# Altium project EL507-LAB002.PrjPcb
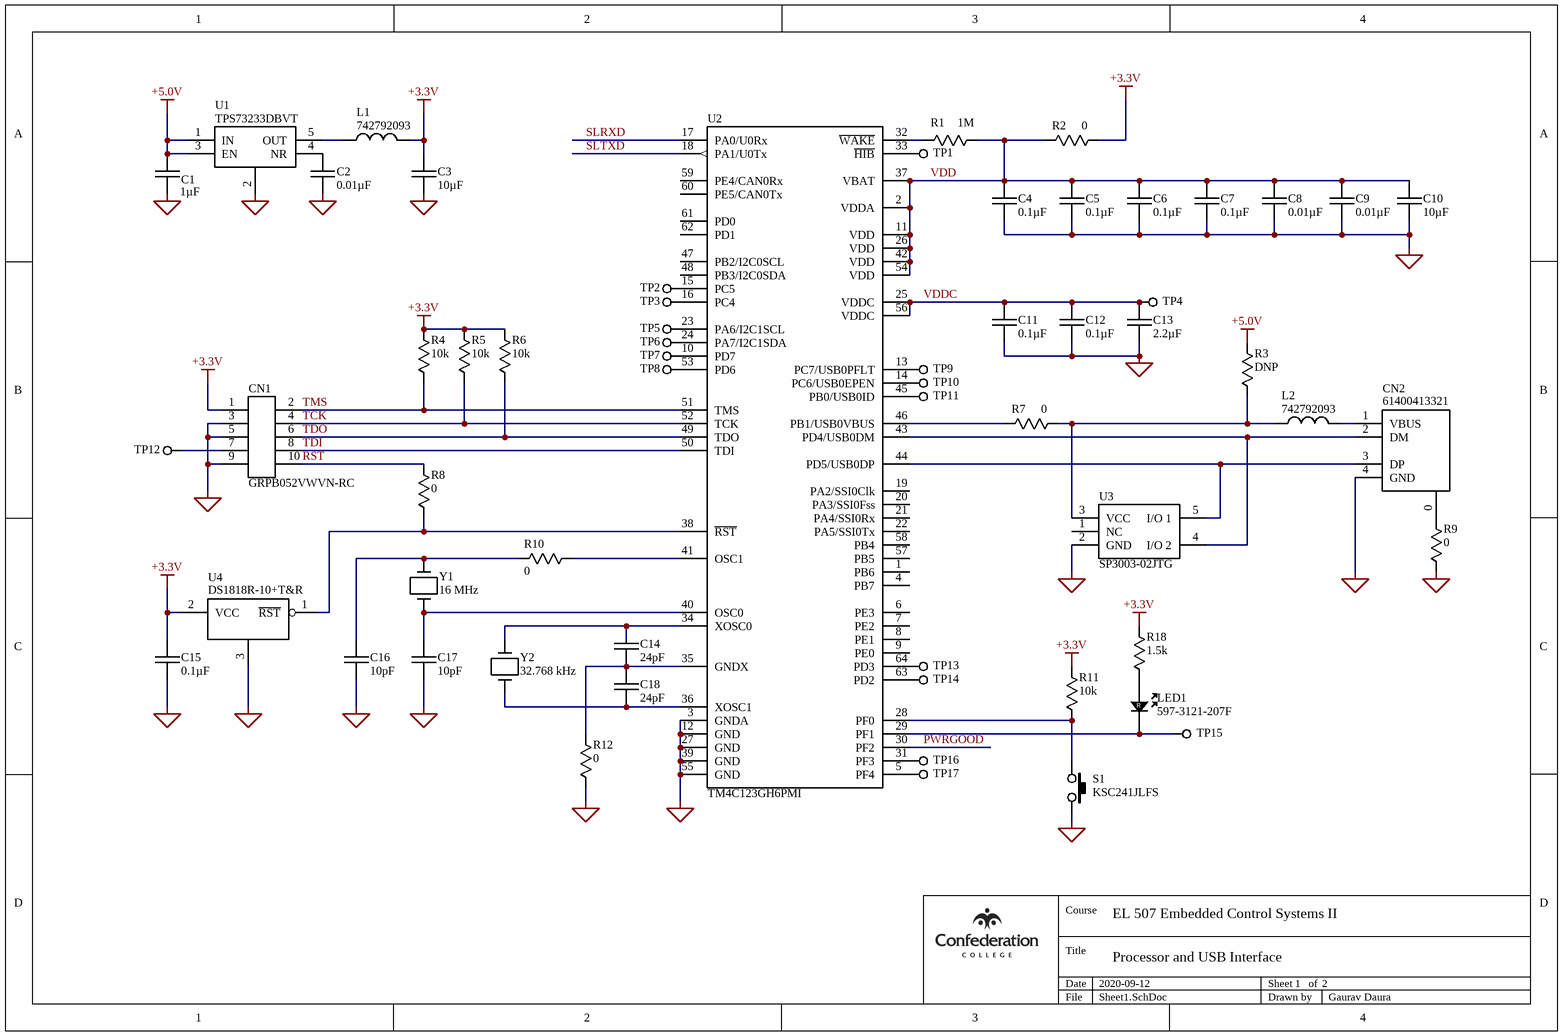
[diagram p0: Sheet1.SchDoc]
2 sheets, 93 parts. Net scope: global (net labels, ports and power ports of the same name join across sheets).
Board file: PCB001.PcbDoc
Sheets:
  Sheet1.SchDoc
  Sheet2.SchDoc

## Sheet Sheet1.SchDoc: Processor and USB Interface
size A4; Date: 2020-09-12; DrawnBy: Gaurav Daura; SheetNumber: 1; SheetTotal: 2

### Parts
C1  1µF  [CAPC2012X135N]
C2  0.01µF  [CAPC2012X78N]
C3  10µF  [CAPC3225X250N]
C4  0.1µF  [CAPC2012X125N]
C5  0.1µF  [CAPC2012X125N]
C6  0.1µF  [CAPC2012X125N]
C7  0.1µF  [CAPC2012X125N]
C8  0.01µF  [CAPC2012X78N]
C9  0.01µF  [CAPC2012X78N]
C10  10µF  [CAPC3225X250N]
C11  0.1µF  [CAPC2012X125N]
C12  0.1µF  [CAPC2012X125N]
C13  2.2µF  [CAPC2012X145N]
C14  24pF  [CAPC2012X75N]
C15  0.1µF  [CAPC2012X125N]
C16  10pF  [CAPC2012X94N]
C17  10pF  [CAPC2012X94N]
C18  24pF  [CAPC2012X75N]
CN1  GRPB052VWVN-RC  [SULLINS_GRPB052VWVN-RC]
CN2  61400413321  [WURTH_61400413321]
L1  742792093  [INDC2012X90N]
L2  742792093  [INDC2012X90N]
LED1  597-3121-207F  [DIALIGHT_597-3121-207F]
R1  1M  [RESC2012X60N]
R2  0  [RESC3216X60N]
R3  DNP  [RESC2012X60N]  (no BOM)
R4  10k  [RESC2012X60N]
R5  10k  [RESC2012X60N]
R6  10k  [RESC2012X60N]
R7  0  [RESC3216X60N]
R8  0  [RESC3216X60N]
R9  0  [RESC3216X60N]
R10  0  [RESC3216X60N]
R11  10k  [RESC2012X60N]
R12  0  [RESC3216X60N]
R18  1.5k  [RESC2012X60N]
S1  KSC241JLFS  [SW_KSC241JLFS]
TP1  TESTPOINT100  [TP100]  (value not drawn)  (no BOM)
TP2  TESTPOINT100  [TP100]  (value not drawn)  (no BOM)
TP3  TESTPOINT100  [TP100]  (value not drawn)  (no BOM)
TP4  TESTPOINT100  [TP100]  (value not drawn)  (no BOM)
TP5  TESTPOINT100  [TP100]  (value not drawn)  (no BOM)
TP6  TESTPOINT100  [TP100]  (value not drawn)  (no BOM)
TP7  TESTPOINT100  [TP100]  (value not drawn)  (no BOM)
TP8  TESTPOINT100  [TP100]  (value not drawn)  (no BOM)
TP9  TESTPOINT100  [TP100]  (value not drawn)  (no BOM)
TP10  TESTPOINT100  [TP100]  (value not drawn)  (no BOM)
TP11  TESTPOINT100  [TP100]  (value not drawn)  (no BOM)
TP12  TESTPOINT100  [TP100]  (value not drawn)  (no BOM)
TP13  TESTPOINT100  [TP100]  (value not drawn)  (no BOM)
TP14  TESTPOINT100  [TP100]  (value not drawn)  (no BOM)
TP15  TESTPOINT100  [TP100]  (value not drawn)  (no BOM)
TP16  TESTPOINT100  [TP100]  (value not drawn)  (no BOM)
TP17  TESTPOINT100  [TP100]  (value not drawn)  (no BOM)
U1  TPS73233DBVT  [SOT95P280X145-5N]
U2  TM4C123GH6PMI  [QFP50P1200X1200X140-64N]
U3  SP3003-02JTG  [SOT65P220X90-5N]
U4  DS1818R-10+T&R  [SOT95P235X100-3N]
Y1  16 MHz  [XTAL500X320X130]
Y2  32.768 kHz  [ABRACON_AB26TRB-32.768KHZ-T]

### Nets
+3.3V: C3.1 C15.1 CN1.1 L1.2 R2.2 R4.2 R5.2 R6.2 R11.2 R18.2 U4.2(VCC)
+5.0V: C1.1 R3.2 U1.1(IN) U1.3(EN)
GND: C1.2 C2.2 C3.2 C4.1 C5.1 C6.1 C7.1 C8.1 C9.1 C10.1 C11.1 C12.1 C13.2 C15.2 C16.2 C17.2 CN1.3 CN1.5 CN1.9 CN2.4(GND) R9.1 R12.1 S1.1 U1.2(GND) U2.3(GNDA) U2.12(GND) U2.27(GND) U2.39(GND) U2.55(GND) U3.2(GND) U4.3(GND)
PWRGOOD: U2.30(PF2)
RST: CN1.10 R8.2
SLRXD: U2.17(PA0/U0Rx)
SLTXD: U2.18(PA1/U0Tx)
TCK: CN1.4 R5.1 U2.52(TCK)
TDI: CN1.8 U2.50(TDI)
TDO: CN1.6 R6.1 U2.49(TDO)
TMS: CN1.2 R4.1 U2.51(TMS)
VDD: C4.2 C5.2 C6.2 C7.2 C8.2 C9.2 C10.2 R1.2 R2.1 U2.2(VDDA) U2.11(VDD) U2.26(VDD) U2.37(VBAT) U2.42(VDD) U2.54(VDD)
VDDC: C11.2 C12.2 C13.1 TP4.1 U2.25(VDDC) U2.56(VDDC)
NetC2_1: C2.1 U1.4(NR)
NetC14_1: C14.1 U2.34(XOSC0) Y2.2
NetC14_2: C14.2 C18.1 R12.2 U2.35(GNDX)
NetC16_1: C16.1 R10.1 Y1.2
NetC17_1: C17.1 U2.40(OSC0) Y1.1
NetC18_2: C18.2 U2.36(XOSC1) Y2.1
NetCN1_7: CN1.7 TP12.1
NetCN2_0: CN2.0 R9.2
NetCN2_1: CN2.1(VBUS) L2.2
NetCN2_2: CN2.2(DM) U2.43(PD4/USB0DM) U3.4(I/O_2)
NetCN2_3: CN2.3(DP) U2.44(PD5/USB0DP) U3.5(I/O_1)
NetL1_1: L1.1 U1.5(OUT)
NetL2_1: L2.1 R3.1 R7.2 U3.3(VCC)
NetLED1_1: LED1.1(K) TP15.1 U2.29(PF1)
NetLED1_2: LED1.2(A) R18.1
NetR1_1: R1.1 U2.32(~{WAKE})
NetR7_1: R7.1 U2.46(PB1/USB0VBUS)
NetR8_1: R8.1 U2.38(~{RST}) U4.1(~{RST})
NetR10_2: R10.2 U2.41(OSC1)
NetR11_1: R11.1 S1.2 U2.28(PF0)
NetTP1_1: TP1.1 U2.33(~{HIB})
NetTP2_1: TP2.1 U2.15(PC5)
NetTP3_1: TP3.1 U2.16(PC4)
NetTP5_1: TP5.1 U2.23(PA6/I2C1SCL)
NetTP6_1: TP6.1 U2.24(PA7/I2C1SDA)
NetTP7_1: TP7.1 U2.10(PD7)
NetTP8_1: TP8.1 U2.53(PD6)
NetTP9_1: TP9.1 U2.13(PC7/USB0PFLT)
NetTP10_1: TP10.1 U2.14(PC6/USB0EPEN)
NetTP11_1: TP11.1 U2.45(PB0/USB0ID)
NetTP13_1: TP13.1 U2.64(PD3)
NetTP14_1: TP14.1 U2.63(PD2)
NetTP16_1: TP16.1 U2.31(PF3)
NetTP17_1: TP17.1 U2.5(PF4)

Not connected (* = marked no-connect by the designer): U2 1(PB6) 4(PB7) 6(PE3) 7(PE2) 8(PE1) 9(PE0) 19(PA2/SSI0Clk) 20(PA3/SSI0Fss) 21(PA4/SSI0Rx) 22(PA5/SSI0Tx) 47(PB2/I2C0SCL) 48(PB3/I2C0SDA) 57(PB5) 58(PB4) 59(PE4/CAN0Rx) 60(PE5/CAN0Tx) 61(PD0) 62(PD1); U3 1(NC)

### Notes on the sheet
- Course
- EL 507 Embedded Control Systems II
- Title
- Date
- Sheet
- of
- File
- Drawn by
- (in symbol 597-3121-207F) R

### Library data of the parts
C1 = CL21B105KBFNNNE: 1µF/50V 10% X7R Multi-Layer Ceramic Capacitor; Manufacturer: Samsung Electro-Mechanics; CRN: 12041; PartNumber: CL21B105KBFNNNE
C2 C8 C9 = CL21B103KBANNNC: 0.01µF/50V 10% X7R Multi-Layer Ceramic Capacitor; Manufacturer: Samsung Electro-Mechanics; CRN: 12041; PartNumber: CL21B103KBANNNC
C3 C10 = UMK325C7106MM-T: 10µF/50V/20% Multilayer Ceramic Chip Capacitor; Manufacturer: Taiyo Yuden; CRN: 12041; PartNumber: UMK325C7106MM-T
C4-C7 C11 C12 C15 = GRM21BR71H104KA01L: 0.1µF/50V/±10% X7R Ceramic Chip Capacitor; Manufacturer: Murata Manufacturing Co., Ltd.; CRN: 12041; PartNumber: GRM21BR71H104KA01L
C13 = UMK212BB7225KG-T: 2.2µF/50V/10% Multilayer Ceramic Chip Capacitor; Manufacturer: Taiyo Yuden; CRN: 12041; PartNumber: UMK212BB7225KG-T
C14 C18 = CL21C240JBANNNC: 24pF/50V 5% C0G Multi-Layer Ceramic Capacitor; Manufacturer: Samsung Electro-Mechanics; CRN: 12041; PartNumber: CL21C240JBANNNC
C16 C17 = 08051A100KAT2A: 10pF 100V NP0 ±10% Ceramic Capacitor; Manufacturer: AVX Corporation; CRN: 12041; PartNumber: 08051A100KAT2A
CN1 = GRPB052VWVN-RC: .050"[1.27mm] Contact Centers, Male Header; Manufacturer: Sullins Connector Solutions, Inc.; CRN: 12041; PartNumber: GRPB052VWVN-RC
CN2 = 61400413321: Connector Receptacle USB Type B 4 Position Through Hole, Vertical; Manufacturer: Wurth Elektronik GmbH & Co. KG; CRN: 12041; PartNumber: 61400413321
L1 L2 = 742792093: Multilayer SMD Ferrite; Manufacturer: Wurth Elektronik GmbH & Co. KG; CRN: 12041; PartNumber: 742792093
LED1 = 597-3121-207F: Micro LED, 597 Series, Red, SMD LED; Manufacturer: Dialight Corporation; CRN: 12041; PartNumber: 597-3121-207F
R1 = ERJ-6ENF1004V: 1M, 1%, 0.125W Precision Thick Film Chip Resistor; Manufacturer: Panasonic Corporation of North America; CRN: 12041; PartNumber: ERJ-6ENF1004V; Value: 1M
R2 R7-R10 R12 = ERJ-8GEY0R00V: 0, 5%, 0.25W Thick Film Chip Resistor; Manufacturer: Panasonic Corporation of North America; CRN: 12041; PartNumber: ERJ-8GEY0R00V; Value: 0
R3 = DNP_RESC2012X60N: 2012 Chip Resistor; Manufacturer: Confederation College; CRN: 12041; PartNumber: -
R4-R6 R11 = ERJ-6ENF1002V: 10k, 1%, 0.125W Precision Thick Film Chip Resistor; Manufacturer: Panasonic Corporation of North America; CRN: 12041; PartNumber: ERJ-6ENF1002V; Value: 10k
R18 = ERJ-6ENF1501V: 1.5k, 1%, 0.125W Precision Thick Film Chip Resistor; Manufacturer: Panasonic Corporation of North America; CRN: 12041; PartNumber: ERJ-6ENF1501V; Value: 1.5k
S1 = KSC241JLFS: KSC Series Sealed Tact Switch for SMT; Manufacturer: C&K Components; CRN: 12041; PartNumber: KSC241JLFS
TP1-TP17 = TESTPOINT100: Test Point; Manufacturer: Confederation College; CRN: 12041; PartNumber: -
U1 = TPS73233DBVT: 250 mA, 3.3V Low Dropout Voltage Regulator; Manufacturer: Texas Instruments, Inc.; CRN: 12041; PartNumber: TPS73233DBVT
U2 = TM4C123GH6PMI: Tiva TM4C123GH6PM Microcontroller; Manufacturer: Texas Instruments, Inc.; CRN: 12041; PartNumber: TM4C123GH6PMI
U3 = SP3003-02JTG: TVS Diode Array - Low Capacitance ESD Protection; Manufacturer: Littelfuse, Inc.; CRN: 12041; PartNumber: SP3003-02JTG
U4 = DS1818R-10+T&R: 3.3 V EconoReset with Pushbutton; Manufacturer: Maxim Integrated; CRN: 12041; PartNumber: DS1818R-10+T&R
Y1 = ABM3-16.000MHZ-B2-T: 16 MHz Miniature Ceramic SMD Crystal; Manufacturer: Abracon Corporation; CRN: 12041; PartNumber: ABM3-16.000MHZ-B2-T
Y2 = AB26TRB-32.768KHZ-T: 32.768 kHz Radial Can Crystal; Manufacturer: Abracon Corporation; CRN: 12041; PartNumber: AB26TRB-32.768KHZ-T

## Sheet Sheet2.SchDoc: Power Supply and Serial Communications
size A4; Date: 2020-09-14; DrawnBy: Gaurav Daura; SheetNumber: 2; SheetTotal: 2
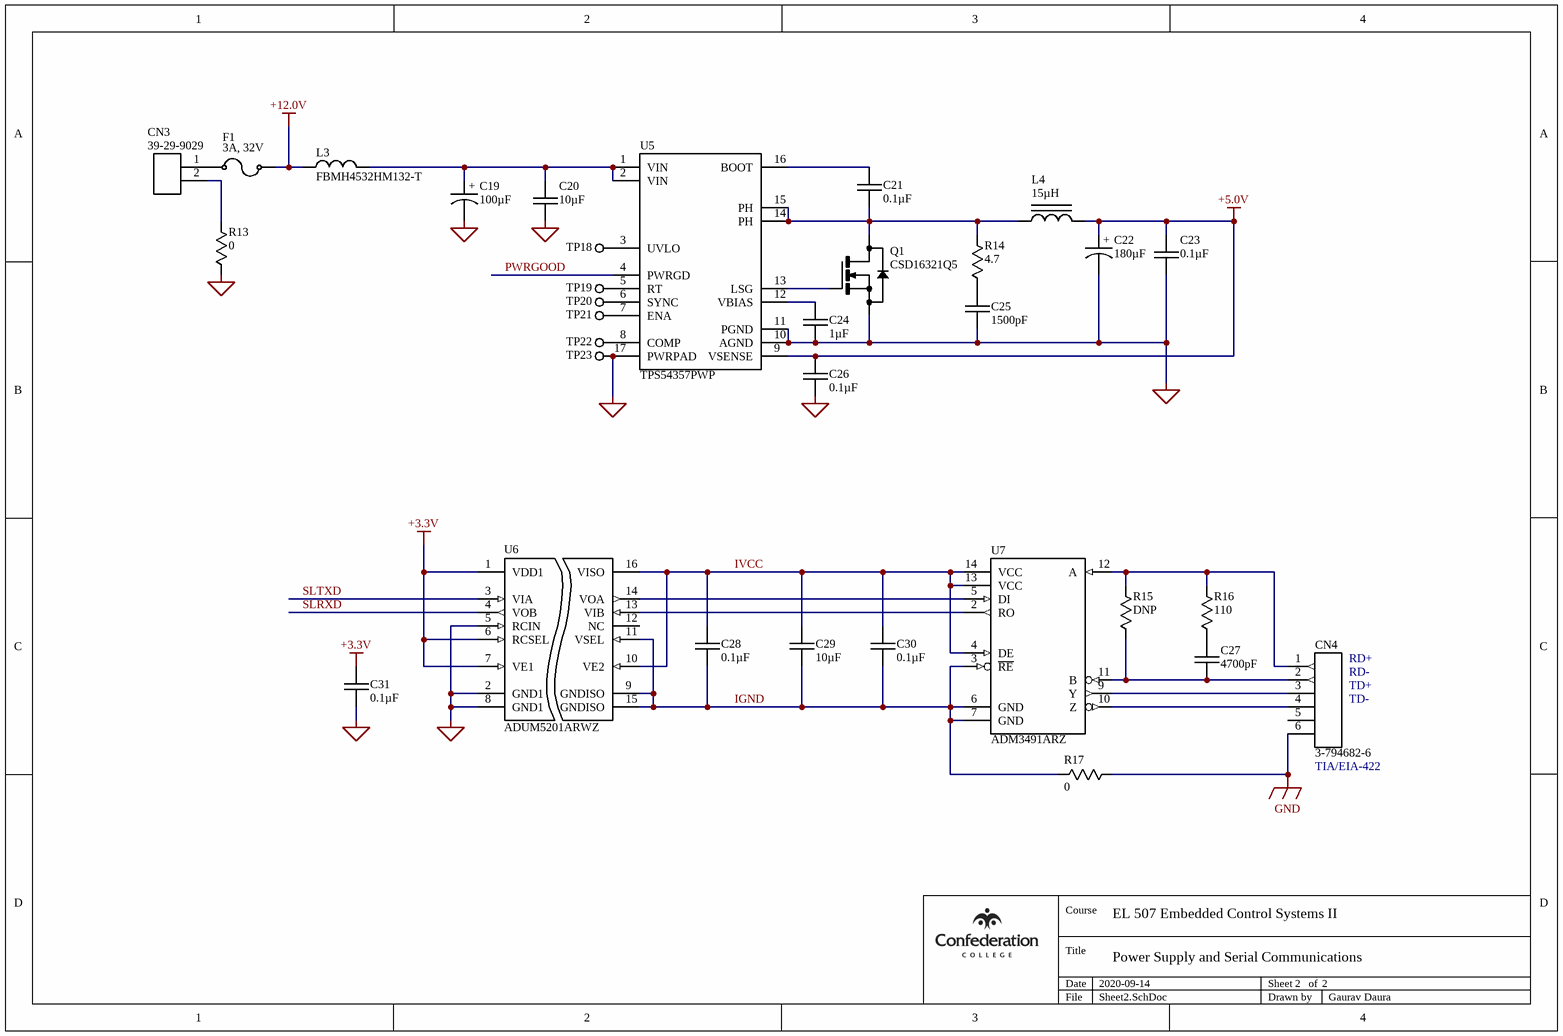
[diagram p1: Sheet2.SchDoc]

### Parts
C19  100µF  [CAPAE660X770N]
C20  10µF  [CAPC3225X250N]
C21  0.1µF  [CAPC2012X125N]
C22  180µF  [CAPMP7343X190N]
C23  0.1µF  [CAPC2012X125N]
C24  1µF  [CAPC2012X135N]
C25  1500pF  [CAPC2012X100N]
C26  0.1µF  [CAPC2012X125N]
C27  4700pF  [CAPC2012X78N]
C28  0.1µF  [CAPC2012X125N]
C29  10µF  [CAPC3225X250N]
C30  0.1µF  [CAPC2012X125N]
C31  0.1µF  [CAPC2012X125N]
CN3  39-29-9029  [MOLEX_39-29-9029]
CN4  3-794682-6  [TYCO_3-794682-6]
F1  3A, 32V  [FUSE_0468XXX.NR]
L3  FBMH4532HM132-T  [INDC4532X350N]
L4  15µH  [IND_SRU1038-150Y]
Q1  CSD16321Q5  [TI_CSD16321Q5]
R13  0  [RESC3216X60N]
R14  4.7  [RESC2012X60N]
R15  DNP  [RESC2012X60N]  (no BOM)
R16  110  [RESC2012X60N]
R17  0  [RESC3216X60N]
TP18  TESTPOINT100  [TP100]  (value not drawn)  (no BOM)
TP19  TESTPOINT100  [TP100]  (value not drawn)  (no BOM)
TP20  TESTPOINT100  [TP100]  (value not drawn)  (no BOM)
TP21  TESTPOINT100  [TP100]  (value not drawn)  (no BOM)
TP22  TESTPOINT100  [TP100]  (value not drawn)  (no BOM)
TP23  TESTPOINT100  [TP100]  (value not drawn)  (no BOM)
U5  TPS54357PWP  [SOP65P640X120-17AN]
U6  ADUM5201ARWZ  [SOIC127P1030X265-16N]
U7  ADM3491ARZ  [SOIC127P600X175-14N]

### Nets
+3.3V: C31.1 U6.1(VDD1) U6.6(RCSEL) U6.7(VE1)
+5.0V: C22.1 C23.1 C26.1 L4.2 U5.9(VSENSE)
+12.0V: F1.2 L3.1
GND: C19.2 C20.2 C22.2 C23.2 C24.2 C25.2 C26.2 C31.2 CN4.6 Q1.S R13.1 R17.2 TP23.1 U5.10(AGND) U5.11(PGND) U5.17(PWRPAD) U6.2(GND1) U6.5(RCIN) U6.8(GND1)
IGND: C28.2 C29.2 C30.2 R17.1 U6.9(GNDISO) U6.11(VSEL) U6.15(GNDISO) U7.3(~{RE}) U7.6(GND) U7.7(GND)
IVCC: C28.1 C29.1 C30.1 U6.10(VE2) U6.16(VISO) U7.4(DE) U7.13(VCC) U7.14(VCC)
PWRGOOD: U5.4(PWRGD)
SLRXD: U6.4(VOB)
SLTXD: U6.3(VIA)
NetC19_1: C19.1 C20.1 L3.2 U5.1(VIN) U5.2(VIN)
NetC21_1: C21.1 U5.16(BOOT)
NetC21_2: C21.2 L4.1 Q1.D R14.2 U5.14(PH) U5.15(PH)
NetC24_1: C24.1 U5.12(VBIAS)
NetC25_1: C25.1 R14.1
NetC27_1: C27.1 R16.1
NetC27_2: C27.2 CN4.2 R15.1 U7.11(B)
NetCN3_1: CN3.1 F1.1
NetCN3_2: CN3.2 R13.2
NetCN4_1: CN4.1 R15.2 R16.2 U7.12(A)
NetCN4_3: CN4.3 U7.9(Y)
NetCN4_4: CN4.4 U7.10(Z)
NetQ1_G: Q1.G U5.13(LSG)
NetTP18_1: TP18.1 U5.3(UVLO)
NetTP19_1: TP19.1 U5.5(RT)
NetTP20_1: TP20.1 U5.6(SYNC)
NetTP21_1: TP21.1 U5.7(ENA)
NetTP22_1: TP22.1 U5.8(COMP)
NetU6_13: U6.13(VIB) U7.2(RO)
NetU6_14: U6.14(VOA) U7.5(DI)

Not connected (* = marked no-connect by the designer): CN4 5; U6 12(NC)

### Notes on the sheet
- (near CN4) RD+
- (near CN4) RD-
- (near CN4) TD+
- (near CN4) TD-
- (near CN4) TIA/EIA-422
- Course
- EL 507 Embedded Control Systems II
- Title
- Date
- Sheet
- of
- File
- Drawn by
- (in symbol EEE-1EA101XP) +
- (in symbol EEF-SE0J181R) +

### Library data of the parts
C19 = EEE-1EA101XP: 100µF/25V/20% Aluminum Electrolytic Capacitor; Manufacturer: Panasonic Corporation of North America; CRN: 12041; PartNumber: EEE-1EA101XP
C20 C29 = UMK325C7106MM-T: as C3 on sheet Sheet1; PartNumber: UMK325C7106MM-T
C21 C23 C26 C28 C30 C31 = GRM21BR71H104KA01L: as C4 on sheet Sheet1; PartNumber: GRM21BR71H104KA01L
C22 = EEF-SE0J181R: 180µF/6.3V/20% Low ESR Polymer Aluminum Capacitor (SP-CAP); Manufacturer: Panasonic Corporation of North America; CRN: 12041; PartNumber: EEF-SE0J181R
C24 = CL21B105KBFNNNE: as C1 on sheet Sheet1; PartNumber: CL21B105KBFNNNE
C25 = GRM21AR72E152KW01D: 1500pF/250V/±10% X7R Ceramic Chip Capacitor; Manufacturer: Murata Manufacturing Co., Ltd.; CRN: 12041; PartNumber: GRM21AR72E152KW01D
C27 = C0805C472K5RACTU: 4700pF/50V/10% Ceramic Capacitor; Manufacturer: Kemet Electronics Corporation; CRN: 12041; PartNumber: C0805C472K5RACTU
CN3 = 39-29-9029: Mini-Fit Jr. Header, Dual Row, Vertical, with Snap-in Plastic Peg PCB Lock, 2 Circuits, PA Polyamide Nylon 6/6 94V-2, 0.76µm Gold (Au) Plating; Manufacturer: Molex Inc.; CRN: 12041; PartNumber: 39-29-9029
CN4 = 3-794682-6: 6 Circuit, Micro MATE-N-LOK 3 mm Vertical Connector; Manufacturer: Tyco Electronics Corporation; CRN: 12041; PartNumber: 3-794682-6
F1 = 0468003.NR: 1 A, 32 V, Slo-Blo, 468 Series Surface Mount Fuse; Manufacturer: Littelfuse, Inc.; CRN: 12041; PartNumber: 0468003.NR
L3 = FBMH4532HM132-T: Multilayer SMD Ferrite Bead, 3A, 1.3k @ 100 MHz; Manufacturer: Taiyo Yuden; CRN: 12041; PartNumber: FBMH4532HM132-T
L4 = SRU1038-150Y: 15µH Shielded SMD Power Inductor; Manufacturer: Bourns, Inc.; CRN: 12041; PartNumber: SRU1038-150Y
Q1 = CSD16321Q5: 25V, 31 A, N-Channel Power MOSFET; Manufacturer: Texas Instruments, Inc.; CRN: 12041; PartNumber: CSD16321Q5
R13 R17 = ERJ-8GEY0R00V: as R2 on sheet Sheet1; PartNumber: ERJ-8GEY0R00V; Value: 0
R14 = ERJ-6GEYJ4R7V: 4.7, ±5%, 0.125W Thick Film Chip Resistor; Manufacturer: Panasonic Corporation of North America; CRN: 12041; PartNumber: ERJ-6GEYJ4R7V; Value: 4.7
R15 = DNP_RESC2012X60N: as R3 on sheet Sheet1; PartNumber: -
R16 = ERJ-6ENF1100V: 110, 1%, 0.125W Precision Thick Film Chip Resistor; Manufacturer: Panasonic Corporation of North America; CRN: 12041; PartNumber: ERJ-6ENF1100V; Value: 110
TP18-TP23 = TESTPOINT100: as TP1 on sheet Sheet1; PartNumber: -
U5 = TPS54357PWP: 5V, 4.5V to 20V Input, 3A Output Synchronous PWM Switcher with Integrated FET (SWIFT); Manufacturer: Texas Instruments, Inc.; CRN: 12041; PartNumber: TPS54357PWP
U6 = ADUM5201ARWZ: 1Mbps Dual Channel Digital Isolator with isoPower Integrated DC-to-DC Converter, 2.5 kV; Manufacturer: Analog Devices, Inc.; CRN: 12041; PartNumber: ADUM5201ARWZ
U7 = ADM3491ARZ: 3.3 V, Full Duplex, 840 uA, 20 Mbps, EIA RS-485 Transceiver; Manufacturer: Analog Devices, Inc.; CRN: 12041; PartNumber: ADM3491ARZ

## Nets that join several sheets
+3.3V: Sheet1 (11 pins), Sheet2 (C31.1 U6.1 U6.6 U6.7)
+5.0V: Sheet1 (C1.1 R3.2 U1.1 U1.3), Sheet2 (5 pins)
GND: Sheet1 (31 pins), Sheet2 (19 pins)
PWRGOOD: Sheet1 (U2.30), Sheet2 (U5.4)
SLRXD: Sheet1 (U2.17), Sheet2 (U6.4)
SLTXD: Sheet1 (U2.18), Sheet2 (U6.3)